# EAGLE schematic Projeto_FonteDeTensao (EAGLE 9.6.2)
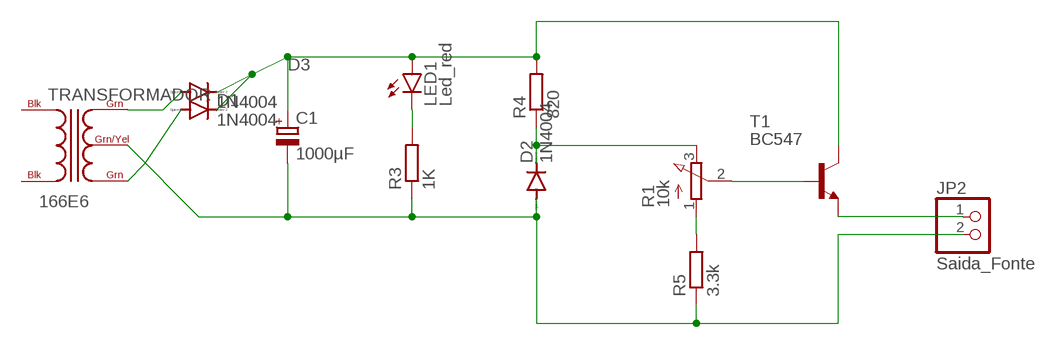
[diagram p0: schematic, sheet 1]

## Parts
C1  1000µF  CPOL-EUE5-10.5  [E5-10,5]
D1  1N4004  [DO41-10]
D2  1N4004  [DO41-10]
D3  1N4004  [DO41-10]
JP2  Saida_Fonte  PINHD-1X2  [1X02]
LED1  Led_red  LED5MM  [LED5MM]
R1  10k  3RP/1610N  [3RP/1610N]
R3  1K  R-EU_0207/10  [0207/10]
R4  820  R-EU_0207/10  [0207/10]
R5  3.3k  R-EU_0207/10  [0207/10]
T1  BC547  [TO92]
TRANSFORMADOR  166E6  [C2H]

## Nets
N$1: D3.A TRANSFORMADOR.GRN@1(GRN)
N$2: D1.A TRANSFORMADOR.GRN@2(GRN)
N$3: C1.+ D1.C D3.C LED1.A R4.2 T1.3(C)
N$4: C1.- D2.A JP2.2 R3.1 R5.1 TRANSFORMADOR.GRN/YEL
N$5: LED1.K(C) R3.2
N$6: D2.C R1.3(E) R4.1
N$7: R1.1(A) R5.2
N$8: R1.2(S) T1.2(B)
N$9: JP2.1 T1.1(E)
Unconnected: TRANSFORMADOR.BLK@1(BLK) TRANSFORMADOR.BLK@2(BLK)

## Library data of the parts
C1 = rcl:CPOL-EU: POLARIZED CAPACITOR, European symbol; SPICEPREFIX: C
D1-D3 = diode:1N4004: DIODE general purpose rectifier, 1 A
JP2 = pinhead:PINHD-1X2: PIN HEADER
LED1 = led:LED: LED OSRAM: - CHIPLED LG R971, LG N971, LY N971, LG Q971, LY Q971, LO R971, LY R971 LH N974, LH R974 LS Q976, LO Q976, LY Q976 LO Q996 - Hyper CHIPLED LW Q18S LB Q993, LB Q99A, LB R99A - SideLED LS A670, LO A670, LY A670, LG A670, LP A670 LB A673, LV A673, LT A673, LW A673 LH A674 LY A675 LS A676, LA A676, LO A676, LY A676, LW A676 LS A679, LY A679, LG A679 - Hyper Micro SIDELED® LS Y876, LA Y876, LO Y876, LY Y876 LT Y87S - SmartLED LW L88C, LW L88S LB L89C, LB L89S, LG L890 LS L89K, LO L89K, LY L89K LS L896, LA L896, LO L896, LY L896 - TOPLED LS T670, LO T670, LY T670, LG T670, LP T670 LSG T670, LSP T670, LSY T670, LOP T670, LYG T670 LG T671, LOG T671, LSG T671 LB T673, LV T673, LT T673, LW T673 LH T674 LS T676, LA T676, LO T676, LY T676, LB T676, LH T676, LSB T676, LW T676 LB T67C, LV T67C, LT T67C, LS T67K, LO T67K, LY T67K, LW E67C LS E67B, LA E67B, LO E67B, LY E67B, LB E67C, LV E67C, LT E67C LW T67C LS T679, LY T679, LG T679 LS T770, LO T770, LY T770, LG T770, LP T770 LB T773, LV T773, LT T773, LW T773 LH T774 LS E675, LA E675, LY E675, LS T675 LS T776, LA T776, LO T776, LY T776, LB T776 LHGB T686 LT T68C, LB T68C - Hyper Mini TOPLED® LB M676 - Mini TOPLED Santana® LG M470 LS M47K, LO M47K, LY M47K Source: http://www.osram.convergy.de LUXEON: - LUMILED® LXK2-PW12-R00, LXK2-PW12-S00, LXK2-PW14-U00, LXK2-PW14-V00 LXK2-PM12-R00, LXK2-PM12-S00, LXK2-PM14-U00 LXK2-PE12-Q00, LXK2-PE12-R00, LXK2-PE12-S00, LXK2-PE14-T00, LXK2-PE14-U00 LXK2-PB12-K00, LXK2-PB12-L00, LXK2-PB12-M00, LXK2-PB14-N00, LXK2-PB14-P00, LXK2-PB14-Q00 LXK2-PR12-L00, LXK2-PR12-M00, LXK2-PR14-Q00, LXK2-PR14-R00 LXK2-PD12-Q00, LXK2-PD12-R00, LXK2-PD12-S00 LXK2-PH12-R00, LXK2-PH12-S00 LXK2-PL12-P00, LXK2-PL12-Q00, LXK2-PL12-R00 Source: www.luxeon.com KINGBRIGHT: KA-3528ASYC Source: www.kingbright.com
R1 = pot:3RP/1610N: 16mm Potentiometer one level Source: http://www.alphapotentiometers.net/html/16mm_pot_2.html
R3-R5 = rcl:R-EU_: RESISTOR, European symbol; SPICEPREFIX: R
T1 = transistor:BC547: NPN TRANSISTOR
TRANSFORMADOR = trafo-hammondmfg:166: OPEN STYLE FILAMENT & L.V. RECTIFIER USE TRANSFORMERS Economical single primnary 115VAC, 60 Hz or 117 VAC 50/60 Hz Source: Data sheet <http://www.hammondmfg.com/166.htm>